# Altium schematic sheet Power.SchDoc
size A4; SheetNumber: 7; SheetTotal: 9
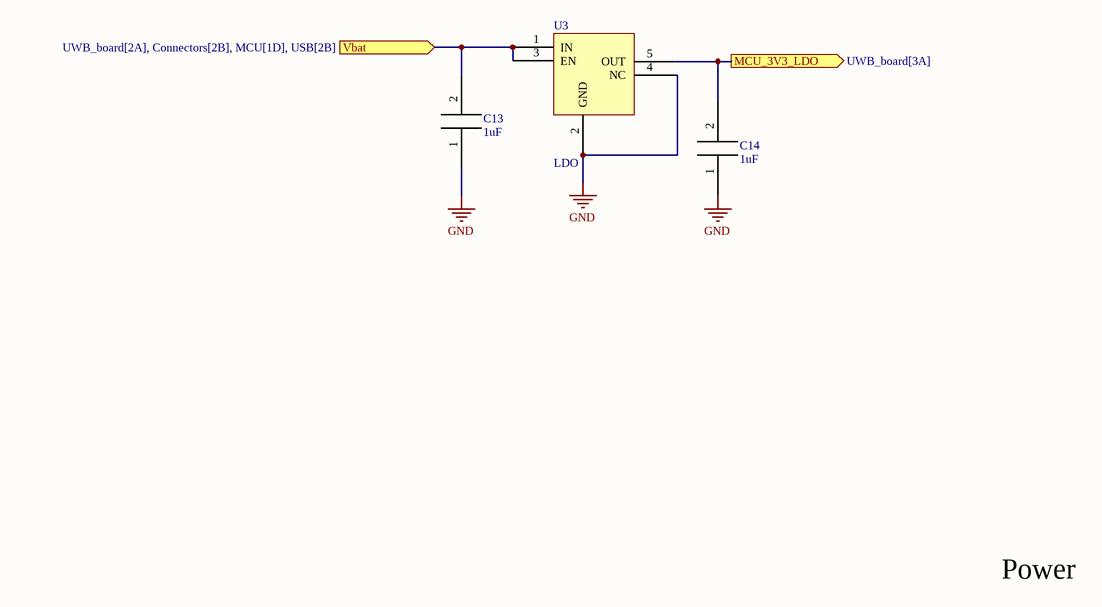
[diagram p0: Power.SchDoc]

## Parts
C13  1uF  [0603_cap]
C14  1uF  [0603_cap]
U3  LDO  [SOT95P280X145-5N]

## Ports
MCU_3V3_LDO (out, see UWB_board[3A]), Vbat (in, see UWB_board[2A], Connectors[2B], MCU[1D], USB[2B])

## Nets
GND: C13.1 C14.1 U3.2(GND) U3.4(NC)
MCU_3V3_LDO: C14.2 U3.5(OUT) ; port MCU_3V3_LDO
Vbat: C13.2 U3.1(IN) U3.3(EN) ; port Vbat

## Notes on the sheet
- Power

## Library data of the parts
C13 C14 = CL10A105KB8NNNC: 1uF 50V X5R ±10% 0603 Multilayer Ceramic Capacitors MLCC - SMD/SMT ROHS; LCSC Part #: C15849; Value: 1uF
U3 = TPS7A20: LCSC Part #: C2862740